# Altium project SecurityTerminal.PrjPCB
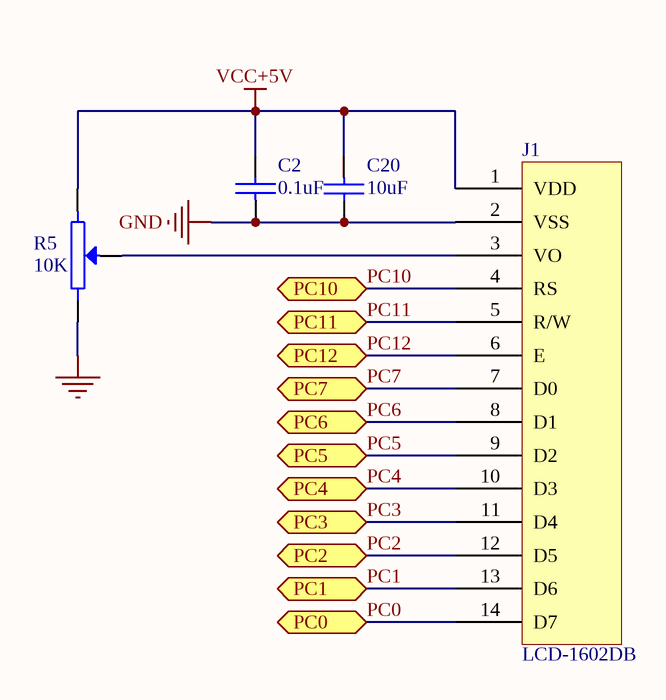
[diagram p0: 1602液晶屏.SchDoc]
5 sheets, 68 parts. Net scope: flat (ports and power ports of the same name join across sheets).
Board file: PCB2.PcbDoc
Sheets:
  1602液晶屏.SchDoc
  CAN.SchDoc
  CPU.SchDoc
  OTHERS.SchDoc
  时钟、存储.SchDoc

## Sheet 1602液晶屏.SchDoc
size A4

### Parts
C2  0.1uF  [0603]
C20  10uF  [0805]
J1  LCD-1602DB  [LCD-1602B]
R5  10K  [RM065-V1]

### Ports
PC0, PC1, PC2, PC3, PC4, PC5, PC6, PC7, PC10, PC11, PC12

### Nets
GND: C2.1 C20.2 J1.2(VSS) R5.3
VCC+5V: C2.2 C20.1 J1.1(VDD) R5.1
PC0: J1.14(D7) ; port PC0
PC1: J1.13(D6) ; port PC1
PC2: J1.12(D5) ; port PC2
PC3: J1.11(D4) ; port PC3
PC4: J1.10(D3) ; port PC4
PC5: J1.9(D2) ; port PC5
PC6: J1.8(D1) ; port PC6
PC7: J1.7(D0) ; port PC7
PC10: J1.4(RS) ; port PC10
PC11: J1.5(R/W) ; port PC11
PC12: J1.6(E) ; port PC12
NetJ1_3: J1.3(VO) R5.2

### Library data of the parts
C2 = CAP-0603: 0603陶瓷贴片电容
C20 = CAP-0805: 0805陶瓷贴片电容
R5 = POT2: 三端可调电位器10K

## Sheet CAN.SchDoc
size A4
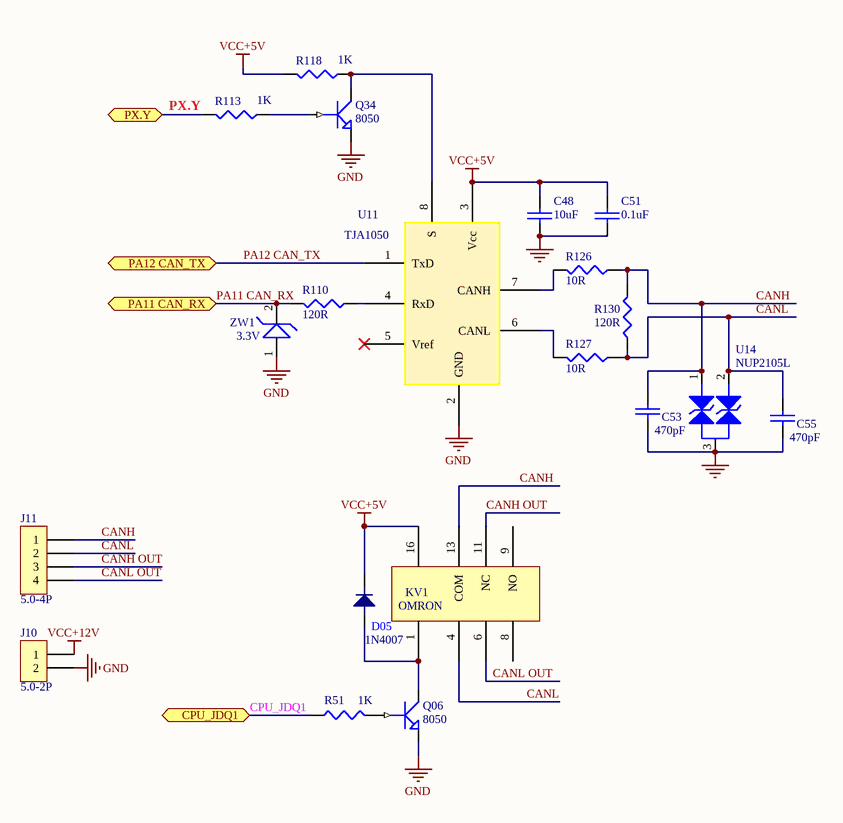
[diagram p1: CAN.SchDoc]

### Parts
C48  10uF  [0805]
C51  0.1uF  [0603]
C53  470pF  [0603]
C55  470pF  [0603]
D05  1N4007  [DO-214AC(SMA)]
J10  5.0-2P  [5.0-2]
J11  5.0-4P  [5.0-4]
KV1  OMRON  [KV]
Q06  8050  [SOT-23]
Q34  8050  [SOT-23]
R51  1K  [0603]
R110  120R  [0603]
R113  1K  [0603]
R118  1K  [0603]
R126  10R  [0603]
R127  10R  [0603]
R130  120R  [0603]
U11  TJA1050  [SO-8]
U14  NUP2105L  [SOT-23]
ZW1  3.3V  [LL-34]

### Ports
CPU_JDQ1, PA11 CAN_RX, PA12 CAN_TX, PX.Y

### Nets
GND: C48.2 C51.1 C53.1 C55.1 J10.2 Q06.2(E) Q34.2(E) U11.2(GND) U14.3 ZW1.1
VCC+5V: C48.1 C51.2 D05.2 KV1.16 R118.2 U11.3(Vcc)
VCC+12V: J10.1
CANH: C53.2 J11.1 KV1.13(COM) R126.1 R130.2 U14.1
CANH OUT: J11.3 KV1.11(NC)
CANL: C55.2 J11.2 KV1.4 R127.1 R130.1 U14.2(K)
CANL OUT: J11.4 KV1.6
CPU_JDQ1: R51.1 ; port CPU_JDQ1
PA11 CAN_RX: R110.2 ZW1.2 ; port PA11 CAN_RX
PA12 CAN_TX: U11.1(TxD) ; port PA12 CAN_TX
PX.Y: R113.2 ; port PX.Y
NetD05_1: D05.1 KV1.1 Q06.3(C)
NetQ06_1: Q06.1(B) R51.2
NetQ34_1: Q34.1(B) R113.1
NetQ34_3: Q34.3(C) R118.1 U11.8(S)
NetR110_1: R110.1 U11.4(RxD)
NetR126_2: R126.2 U11.7(CANH)
NetR127_2: R127.2 U11.6(CANL)

Not connected (* = marked no-connect by the designer): KV1 8(3) 9(NO); U11 5(Vref)*

### Library data of the parts
C48 = CAP-0805: 0805陶瓷贴片电容
C51 C53 C55 = CAP-0603: 0603陶瓷贴片电容
D05 = 1N4007: 1A整流二极管
J10 = 5.0-2P: WJ301V-5.00-2P
J11 = 5.0-4P: WJ301V-5.00-4P
KV1 = OMRON: omron G5V-2 12VDC
Q06 = NPN1
Q34 = 8050: 8050 NPN型三极管
R51 = RES1
R110 R113 R118 R126 R127 R130 = RES-0603: 陶瓷贴片电阻0603封装
U11 = TJA1050: TJA1050   CAN芯片
U14 = NUP2105L: NUP2105L  TVS三极管
ZW1 = 3.3V: ZMM3V3

## Sheet CPU.SchDoc
size A4
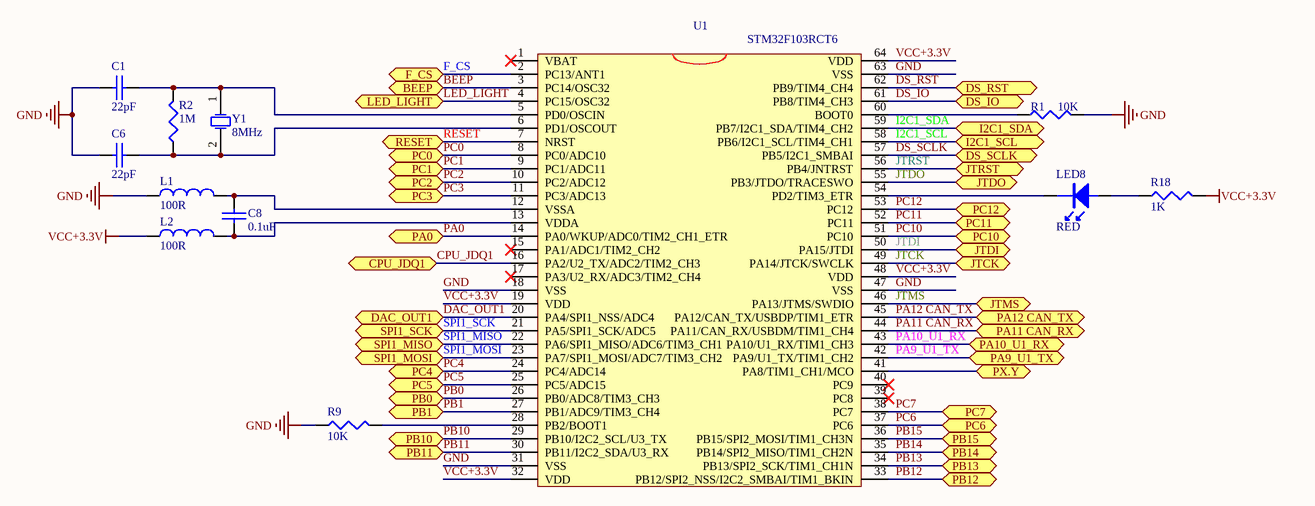
[diagram p2: CPU.SchDoc]

### Parts
C1  22pF  [0603]
C6  22pF  [0603]
C8  0.1uF  [0603]
L1  100R  [0805]
L2  100R  [0805]
LED8  RED  [LED-0603]
R1  10K  [0603]
R2  1M  [0603]
R9  10K  [0603]
R18  1K  [0603]
U1  STM32F103RCT6  [LQFP64_N]
Y1  8MHz  [XTAL_US]

### Ports
BEEP, CPU_JDQ1, DAC_OUT1, DS_IO, DS_RST, DS_SCLK, F_CS, I2C1_SCL, I2C1_SDA, JTCK, JTDI, JTDO, JTMS, JTRST, LED_LIGHT, PA0, PA9_U1_TX, PA10_U1_RX, PA11 CAN_RX, PA12 CAN_TX, PB0, PB1, PB10, PB11, PB12, PB13, PB14, PB15, PC0, PC1, PC2, PC3, PC4, PC5, PC6, PC7, PC10, PC11, PC12, PX.Y, RESET, SPI1_MISO, SPI1_MOSI, SPI1_SCK

### Nets
GND: C1.1 C6.1 L1.1 R1.2 R9.1 U1.18(VSS) U1.31(VSS) U1.47(VSS) U1.63(VSS)
VCC+3.3V: L2.1 R18.2 U1.19(VDD) U1.32(VDD) U1.48(VDD) U1.64(VDD)
BEEP: U1.3(PC14/OSC32) ; port BEEP
CPU_JDQ1: U1.16(PA2/U2_TX/ADC2/TIM2_CH3) ; port CPU_JDQ1
DAC_OUT1: U1.20(PA4/SPI1_NSS/ADC4) ; port DAC_OUT1
DS_IO: U1.61(PB8/TIM4_CH3) ; port DS_IO
DS_RST: U1.62(PB9/TIM4_CH4) ; port DS_RST
DS_SCLK: U1.57(PB5/I2C1_SMBAI) ; port DS_SCLK
F_CS: U1.2(PC13/ANT1) ; port F_CS
I2C1_SCL: U1.58(PB6/I2C1_SCL/TIM4_CH1) ; port I2C1_SCL
I2C1_SDA: U1.59(PB7/I2C1_SDA/TIM4_CH2) ; port I2C1_SDA
JTCK: U1.49(PA14/JTCK/SWCLK) ; port JTCK
JTDI: U1.50(PA15/JTDI) ; port JTDI
JTDO: U1.55(PB3/JTDO/TRACESWO) ; port JTDO
JTMS: U1.46(PA13/JTMS/SWDIO) ; port JTMS
JTRST: U1.56(PB4/JNTRST) ; port JTRST
LED_LIGHT: U1.4(PC15/OSC32) ; port LED_LIGHT
PA0: U1.14(PA0/WKUP/ADC0/TIM2_CH1_ETR) ; port PA0
PA9_U1_TX: U1.42(PA9/U1_TX/TIM1_CH2) ; port PA9_U1_TX
PA10_U1_RX: U1.43(PA10/U1_RX/TIM1_CH3) ; port PA10_U1_RX
PA11 CAN_RX: U1.44(PA11/CAN_RX/USBDM/TIM1_CH4) ; port PA11 CAN_RX
PA12 CAN_TX: U1.45(PA12/CAN_TX/USBDP/TIM1_ETR) ; port PA12 CAN_TX
PB0: U1.26(PB0/ADC8/TIM3_CH3) ; port PB0
PB1: U1.27(PB1/ADC9/TIM3_CH4) ; port PB1
PB10: U1.29(PB10/I2C2_SCL/U3_TX) ; port PB10
PB11: U1.30(PB11/I2C2_SDA/U3_RX) ; port PB11
PB12: U1.33(PB12/SPI2_NSS/I2C2_SMBAI/TIM1_BKIN) ; port PB12
PB13: U1.34(PB13/SPI2_SCK/TIM1_CH1N) ; port PB13
PB14: U1.35(PB14/SPI2_MISO/TIM1_CH2N) ; port PB14
PB15: U1.36(PB15/SPI2_MOSI/TIM1_CH3N) ; port PB15
PC0: U1.8(PC0/ADC10) ; port PC0
PC1: U1.9(PC1/ADC11) ; port PC1
PC2: U1.10(PC2/ADC12) ; port PC2
PC3: U1.11(PC3/ADC13) ; port PC3
PC4: U1.24(PC4/ADC14) ; port PC4
PC5: U1.25(PC5/ADC15) ; port PC5
PC6: U1.37(PC6) ; port PC6
PC7: U1.38(PC7) ; port PC7
PC10: U1.51(PC10) ; port PC10
PC11: U1.52(PC11) ; port PC11
PC12: U1.53(PC12) ; port PC12
PX.Y: U1.41(PA8/TIM1_CH1/MCO) ; port PX.Y
RESET: U1.7(NRST) ; port RESET
SPI1_MISO: U1.22(PA6/SPI1_MISO/ADC6/TIM3_CH1) ; port SPI1_MISO
SPI1_MOSI: U1.23(PA7/SPI1_MOSI/ADC7/TIM3_CH2) ; port SPI1_MOSI
SPI1_SCK: U1.21(PA5/SPI1_SCK/ADC5) ; port SPI1_SCK
NetC1_2: C1.2 R2.2 U1.5(PD0/OSCIN) Y1.1(OSC1)
NetC6_2: C6.2 R2.1 U1.6(PD1/OSCOUT) Y1.2(OSC2)
NetC8_1: C8.1 L2.2 U1.13(VDDA)
NetC8_2: C8.2 L1.2 U1.12(VSSA)
NetLED8_1: LED8.1 R18.1
NetLED8_2: LED8.2 U1.54(PD2/TIM3_ETR)
NetR1_1: R1.1 U1.60(BOOT0)
NetR9_2: R9.2 U1.28(PB2/BOOT1)

Not connected (* = marked no-connect by the designer): U1 1(VBAT)* 15(PA1/ADC1/TIM2_CH2)* 17(PA3/U2_RX/ADC3/TIM2_CH4)* 39(PC8)* 40(PC9)*

### Library data of the parts
C1 C6 C8 = CAP-0603: 0603陶瓷贴片电容
L1 L2 = INDUCTOR
LED8 = LED-0603: LED贴片发光二极管0603封装
R1 R2 R9 R18 = RES-0603: 陶瓷贴片电阻0603封装
U1 = STM32F103RBT6: STM32F103RCT6   LQFP64封装
Y1 = XTAL: Crystal Oscillator; Published: 8-Jun-2000; LatestRevisionDate: 17-Jul-2002; LatestRevisionNote: Re-released for DXP Platform.; Publisher: Altium Limited

## Sheet OTHERS.SchDoc
size A4
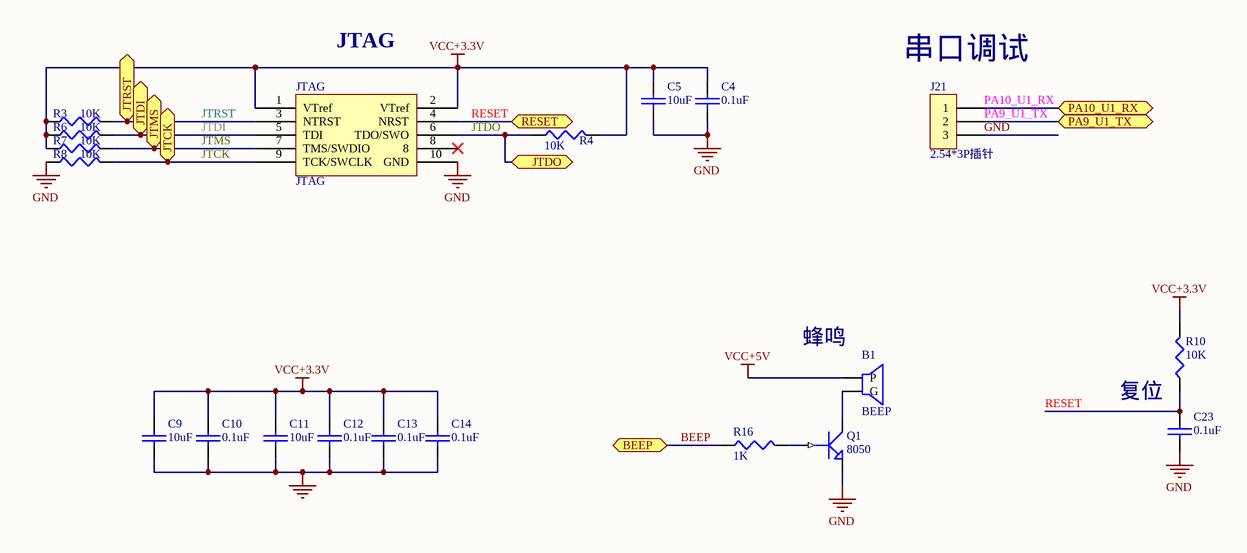
[diagram p3: OTHERS.SchDoc]

### Parts
B1  BEEP  [BEEP-W]
C4  0.1uF  [0603]
C5  10uF  [0805]
C9  10uF  [0805]
C10  0.1uF  [0603]
C11  10uF  [0805]
C12  0.1uF  [0603]
C13  0.1uF  [0603]
C14  0.1uF  [0603]
C23  0.1uF  [0603]
J21  2.54*3P插针  [2.54-TX]
JTAG  JTAG  [JTAG_10]
Q1  8050  [SOT-23]
R3  10K  [0603]
R4  10K  [0603]
R6  10K  [0603]
R7  10K  [0603]
R8  10K  [0603]
R10  10K  [0603]
R16  1K  [0603]

### Ports
BEEP, JTCK, JTDI, JTDO, JTMS, JTRST, PA9_U1_TX, PA10_U1_RX, RESET

### Nets
GND: C4.1 C5.2 C9.2 C10.1 C11.2 C12.1 C13.1 C14.1 C23.1 J21.3 JTAG.10(GND) Q1.2(E) R8.1
VCC+3.3V: C4.2 C5.1 C9.1 C10.2 C11.1 C12.2 C13.2 C14.2 JTAG.1(VTref) JTAG.2(VTref) R3.1 R4.2 R6.1 R7.1 R10.2
VCC+5V: B1.1(P)
BEEP: R16.1 ; port BEEP
JTCK: JTAG.9(TCK/SWCLK) R8.2 ; port JTCK
JTDI: JTAG.5(TDI) R6.2 ; port JTDI
JTDO: JTAG.6(TDO/SWO) R4.1 ; port JTDO
JTMS: JTAG.7(TMS/SWDIO) R7.2 ; port JTMS
JTRST: JTAG.3(NTRST) R3.2 ; port JTRST
PA9_U1_TX: J21.2 ; port PA9_U1_TX
PA10_U1_RX: J21.1 ; port PA10_U1_RX
RESET: C23.2 JTAG.4(NRST) R10.1 ; port RESET
NetB1_2: B1.2(G) Q1.3(C)
NetQ1_1: Q1.1(B) R16.2

Not connected (* = marked no-connect by the designer): JTAG 8*

### Notes on the sheet
- JTAG
- (near J21) 串口调试
- (near B1) 蜂鸣
- 复位

### Library data of the parts
B1 = BEEP: TMB12A05  5V有源电磁蜂鸣器
C4 C10 C12-C14 C23 = CAP-0603: 0603陶瓷贴片电容
C5 C9 C11 = CAP-0805: 0805陶瓷贴片电容
J21 = 2.54*3P插针: 2.54mm*3P单排插针
JTAG = JTAG: 2.54*5*2   2.54mm 5P双排排阵
Q1 = 8050: 8050 NPN型三极管
R3 R4 R6-R8 R10 R16 = RES-0603: 陶瓷贴片电阻0603封装

## Sheet 时钟、存储.SchDoc
size A4
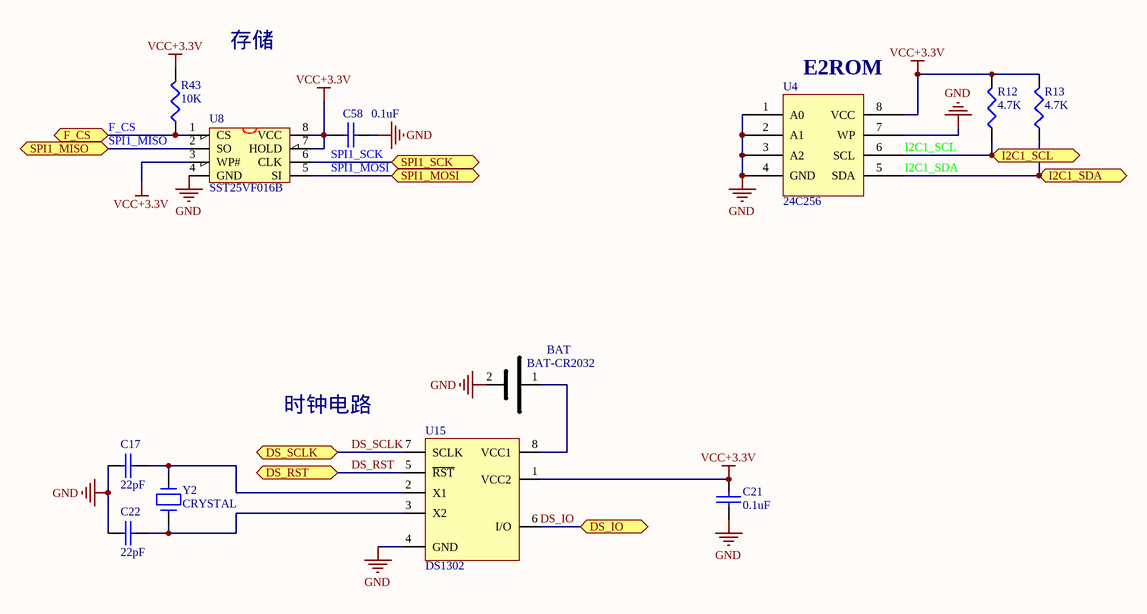
[diagram p4: 时钟、存储.SchDoc]

### Parts
BAT  BAT-CR2032  [CR2032]
C17  22pF  [0603]
C21  0.1uF  [0603]
C22  22pF  [0603]
C58  0.1uF  [0603]
R12  4.7K  [0603]
R13  4.7K  [0603]
R43  10K  [0603]
U4  24C256  [SO-8]
U8  SST25VF016B  [SOIC-8]
U15  DS1302  [SO-8]
Y2  CRYSTAL  [CS206]

### Ports
DS_IO, DS_RST, DS_SCLK, F_CS, I2C1_SCL, I2C1_SDA, SPI1_MISO, SPI1_MOSI, SPI1_SCK

### Nets
GND: BAT.2 C17.1 C21.1 C22.1 C58.1 U4.1(A0) U4.2(A1) U4.3(A2) U4.4(GND) U4.7(WP) U8.4(GND) U15.4(GND)
VCC+3.3V: C21.2 C58.2 R12.2 R13.2 R43.2 U4.8(VCC) U8.3(WP#) U8.7(HOLD) U8.8(VCC) U15.1(VCC2)
DS_IO: U15.6(I/O) ; port DS_IO
DS_RST: U15.5(~{R}~{S}~{T}) ; port DS_RST
DS_SCLK: U15.7(SCLK) ; port DS_SCLK
F_CS: R43.1 U8.1(CS) ; port F_CS
I2C1_SCL: R12.1 U4.6(SCL) ; port I2C1_SCL
I2C1_SDA: R13.1 U4.5(SDA) ; port I2C1_SDA
SPI1_MISO: U8.2(SO) ; port SPI1_MISO
SPI1_MOSI: U8.5(SI) ; port SPI1_MOSI
SPI1_SCK: U8.6(CLK) ; port SPI1_SCK
NetBAT_1: BAT.1 U15.8(VCC1)
NetC17_2: C17.2 U15.2(X1) Y2.2
NetC22_2: C22.2 U15.3(X2) Y2.1

### Notes on the sheet
- 存储
- (near U4) E2ROM
- 时钟电路

### Library data of the parts
BAT = BAT-CR2032: CR2032电池座
C17 C21 C22 = CAP-0603: 0603陶瓷贴片电容
C58 = CAP
R12 R13 R43 = RES-0603: 陶瓷贴片电阻0603封装
U4 = 24C256: E2PROM
U8 = SST25VF016B: SST25VF016  SPI FLASH
U15 = DS1302: DS1302   时钟芯片
Y2 = CRYSTAL: 晶体振荡器2*6

## Nets that join several sheets
GND: 1602液晶屏 (C2.1 C20.2 J1.2 R5.3), CAN (10 pins), CPU (9 pins), OTHERS (13 pins), 时钟、存储 (12 pins)
VCC+3.3V: CPU (6 pins), OTHERS (15 pins), 时钟、存储 (10 pins)
VCC+5V: 1602液晶屏 (C2.2 C20.1 J1.1 R5.1), CAN (6 pins), OTHERS (B1.1)
BEEP: CPU (U1.3), OTHERS (R16.1)
CPU_JDQ1: CAN (R51.1), CPU (U1.16)
DS_IO: CPU (U1.61), 时钟、存储 (U15.6)
DS_RST: CPU (U1.62), 时钟、存储 (U15.5)
DS_SCLK: CPU (U1.57), 时钟、存储 (U15.7)
F_CS: CPU (U1.2), 时钟、存储 (R43.1 U8.1)
I2C1_SCL: CPU (U1.58), 时钟、存储 (R12.1 U4.6)
I2C1_SDA: CPU (U1.59), 时钟、存储 (R13.1 U4.5)
JTCK: CPU (U1.49), OTHERS (JTAG.9 R8.2)
JTDI: CPU (U1.50), OTHERS (JTAG.5 R6.2)
JTDO: CPU (U1.55), OTHERS (JTAG.6 R4.1)
JTMS: CPU (U1.46), OTHERS (JTAG.7 R7.2)
JTRST: CPU (U1.56), OTHERS (JTAG.3 R3.2)
PA9_U1_TX: CPU (U1.42), OTHERS (J21.2)
PA10_U1_RX: CPU (U1.43), OTHERS (J21.1)
PA11 CAN_RX: CAN (R110.2 ZW1.2), CPU (U1.44)
PA12 CAN_TX: CAN (U11.1), CPU (U1.45)
PC0: 1602液晶屏 (J1.14), CPU (U1.8)
PC1: 1602液晶屏 (J1.13), CPU (U1.9)
PC2: 1602液晶屏 (J1.12), CPU (U1.10)
PC3: 1602液晶屏 (J1.11), CPU (U1.11)
PC4: 1602液晶屏 (J1.10), CPU (U1.24)
PC5: 1602液晶屏 (J1.9), CPU (U1.25)
PC6: 1602液晶屏 (J1.8), CPU (U1.37)
PC7: 1602液晶屏 (J1.7), CPU (U1.38)
PC10: 1602液晶屏 (J1.4), CPU (U1.51)
PC11: 1602液晶屏 (J1.5), CPU (U1.52)
PC12: 1602液晶屏 (J1.6), CPU (U1.53)
PX.Y: CAN (R113.2), CPU (U1.41)
RESET: CPU (U1.7), OTHERS (C23.2 JTAG.4 R10.1)
SPI1_MISO: CPU (U1.22), 时钟、存储 (U8.2)
SPI1_MOSI: CPU (U1.23), 时钟、存储 (U8.5)
SPI1_SCK: CPU (U1.21), 时钟、存储 (U8.6)